# Altium schematic sheet Circuit.SchDoc
size A4
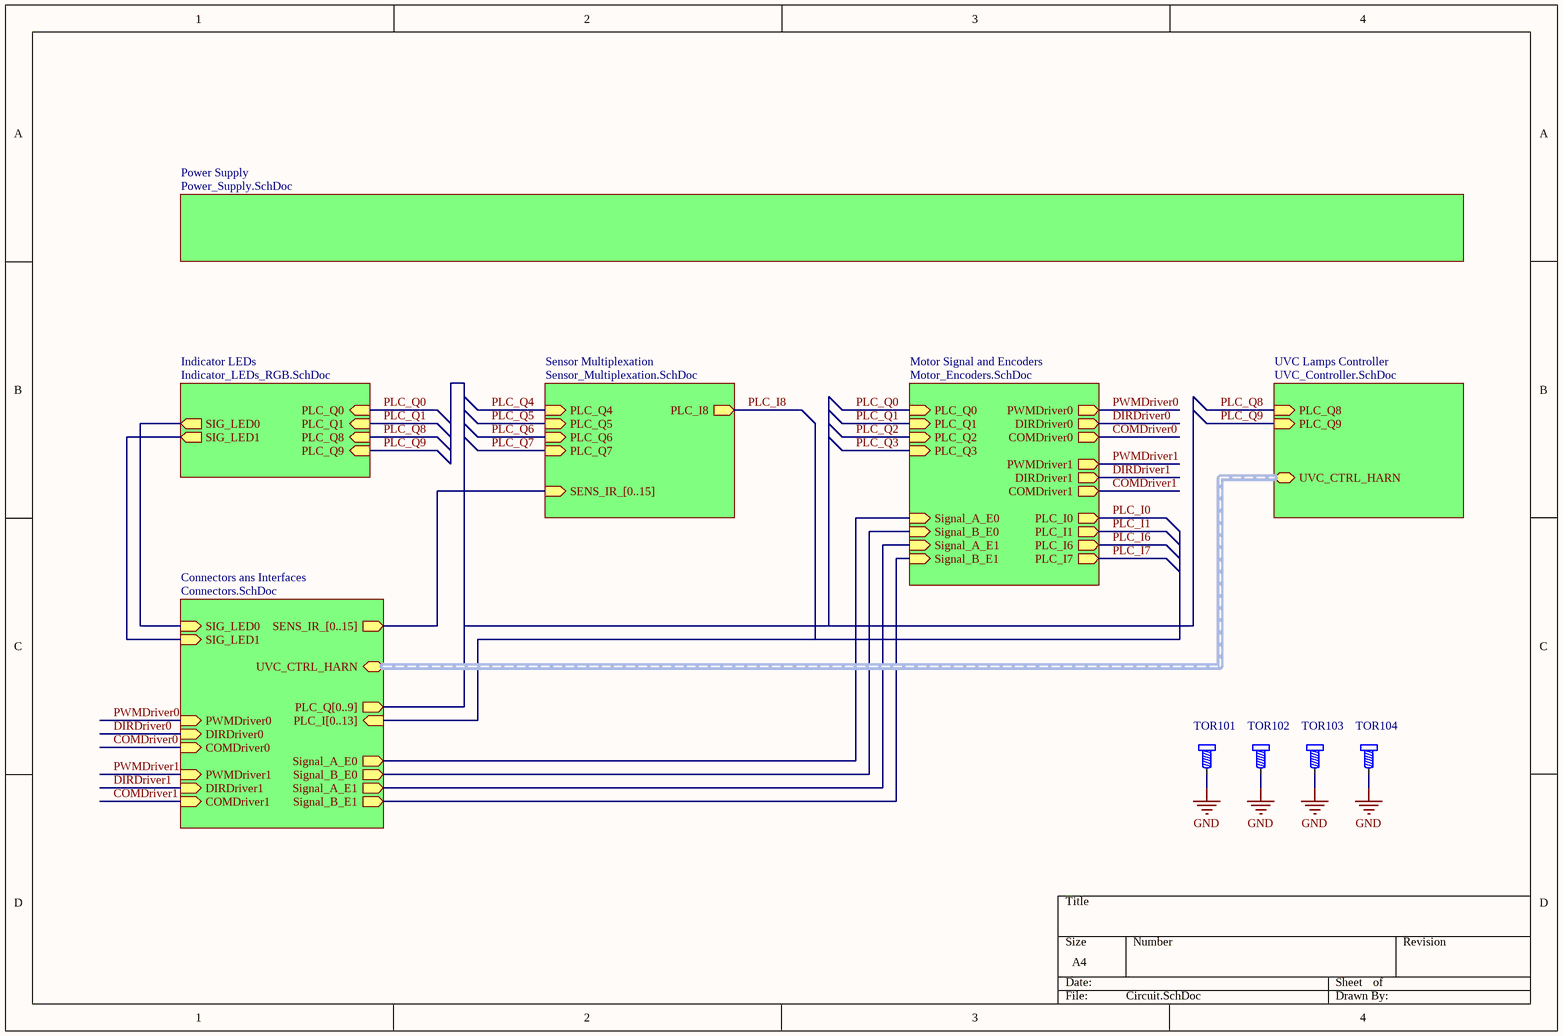
[diagram p0: Circuit.SchDoc]

## Parts
TOR101  SUJETADOR  [TOR_ALEM_M3]  (value not drawn)
TOR102  SUJETADOR  [TOR_ALEM_M3]  (value not drawn)
TOR103  SUJETADOR  [TOR_ALEM_M3]  (value not drawn)
TOR104  SUJETADOR  [TOR_ALEM_M3]  (value not drawn)

## Sub-sheets
Connectors ans Interfaces = Connectors.SchDoc: SENS_IR_[0..15] (out), UVC_CTRL_HARN (harness UVC_CTRL_HARN), PLC_Q[0..9] (out), PLC_I[0..13] (in), Signal_A_E0 (out), Signal_B_E0 (out), Signal_A_E1 (out), Signal_B_E1 (out), PWMDriver0 (in), DIRDriver0 (in), COMDriver0 (in), PWMDriver1 (in), DIRDriver1 (in), COMDriver1 (in), SIG_LED0 (in), SIG_LED1 (in)
Indicator LEDs = Indicator_LEDs_RGB.SchDoc: PLC_Q8 (in), PLC_Q9 (in), PLC_Q0 (in), PLC_Q1 (in), SIG_LED0 (out), SIG_LED1 (out)
Motor Signal and Encoders = Motor_Encoders.SchDoc: PLC_I0 (out), PLC_I6 (out), PLC_Q0 (in), PLC_Q2 (in), PLC_I1 (out), PLC_I7 (out), PLC_Q1 (in), PLC_Q3 (in), DIRDriver0 (out), COMDriver0 (out), DIRDriver1 (out), COMDriver1 (out), Signal_A_E0 (in), Signal_B_E0 (in), Signal_A_E1 (in), Signal_B_E1 (in), PWMDriver0 (out), PWMDriver1 (out)
Power Supply = Power_Supply.SchDoc: no entries
Sensor Multiplexation = Sensor_Multiplexation.SchDoc: SENS_IR_[0..15] (in), PLC_Q4 (in), PLC_Q5 (in), PLC_Q6 (in), PLC_Q7 (in), PLC_I8 (out)
UVC Lamps Controller = UVC_Controller.SchDoc: PLC_Q8 (in), PLC_Q9 (in), UVC_CTRL_HARN (harness UVC_CTRL_HARN)

## Nets
GND: TOR101.1 TOR102.1 TOR103.1 TOR104.1
COMDriver0: sheet Motor Signal and Encoders/COMDriver0, sheet Connectors ans Interfaces/COMDriver0
COMDriver1: sheet Motor Signal and Encoders/COMDriver1, sheet Connectors ans Interfaces/COMDriver1
DIRDriver0: sheet Motor Signal and Encoders/DIRDriver0, sheet Connectors ans Interfaces/DIRDriver0
DIRDriver1: sheet Motor Signal and Encoders/DIRDriver1, sheet Connectors ans Interfaces/DIRDriver1
PLC_I0: sheet Motor Signal and Encoders/PLC_I0
PLC_I1: sheet Motor Signal and Encoders/PLC_I1
PLC_I6: sheet Motor Signal and Encoders/PLC_I6
PLC_I7: sheet Motor Signal and Encoders/PLC_I7
PLC_I8: sheet Sensor Multiplexation/PLC_I8
PLC_Q0: sheet Indicator LEDs/PLC_Q0, sheet Motor Signal and Encoders/PLC_Q0
PLC_Q1: sheet Indicator LEDs/PLC_Q1, sheet Motor Signal and Encoders/PLC_Q1
PLC_Q2: sheet Motor Signal and Encoders/PLC_Q2
PLC_Q3: sheet Motor Signal and Encoders/PLC_Q3
PLC_Q4: sheet Sensor Multiplexation/PLC_Q4
PLC_Q5: sheet Sensor Multiplexation/PLC_Q5
PLC_Q6: sheet Sensor Multiplexation/PLC_Q6
PLC_Q7: sheet Sensor Multiplexation/PLC_Q7
PLC_Q8: sheet Indicator LEDs/PLC_Q8, sheet UVC Lamps Controller/PLC_Q8
PLC_Q9: sheet Indicator LEDs/PLC_Q9, sheet UVC Lamps Controller/PLC_Q9
PWMDriver0: sheet Motor Signal and Encoders/PWMDriver0, sheet Connectors ans Interfaces/PWMDriver0
PWMDriver1: sheet Motor Signal and Encoders/PWMDriver1, sheet Connectors ans Interfaces/PWMDriver1
(unnamed): sheet Indicator LEDs/SIG_LED0, sheet Connectors ans Interfaces/SIG_LED0
(unnamed): sheet Indicator LEDs/SIG_LED1, sheet Connectors ans Interfaces/SIG_LED1
(unnamed): sheet Motor Signal and Encoders/Signal_A_E0, sheet Connectors ans Interfaces/Signal_A_E0
(unnamed): sheet Motor Signal and Encoders/Signal_B_E0, sheet Connectors ans Interfaces/Signal_B_E0
(unnamed): sheet Motor Signal and Encoders/Signal_A_E1, sheet Connectors ans Interfaces/Signal_A_E1
(unnamed): sheet Motor Signal and Encoders/Signal_B_E1, sheet Connectors ans Interfaces/Signal_B_E1

## Buses and harness runs
bus sheet Connectors ans Interfaces/SENS_IR_[0..15] = sheet Sensor Multiplexation/SENS_IR_[0..15]
harness sheet Connectors ans Interfaces/UVC_CTRL_HARN = sheet UVC Lamps Controller/UVC_CTRL_HARN

## Library data of the parts
TOR101-TOR104 = Tornillos Sujecion: Agujero para tornillo ed sujecion ed placa; PROVEEDOR: Bultor; CODIGO STI: *; FABRICANTE: *